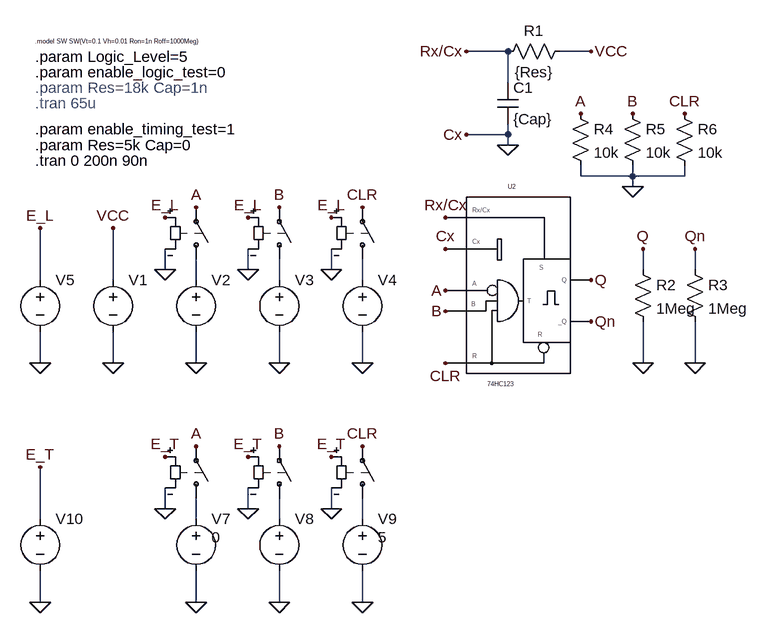
[diagram p0: schematic Test (If Spice works) 74HC123.asc]
Test (If Spice works) 74HC123.asc, the LTspice schematic file:
Version 4.1
SHEET 1 1260 1556
WIRE 240 -160 176 -160
WIRE 368 -160 320 -160
WIRE 240 -112 240 -160
WIRE 240 -32 240 -48
WIRE 240 -32 176 -32
WIRE 240 -16 240 -32
WIRE 352 32 352 16
WIRE 432 32 432 16
WIRE 432 32 352 32
WIRE 512 32 512 16
WIRE 512 32 432 32
WIRE 432 48 432 32
WIRE -288 176 -288 144
WIRE -160 176 -160 144
WIRE -32 176 -32 144
WIRE 448 176 448 144
WIRE 528 176 528 144
WIRE -480 192 -480 112
WIRE -368 192 -368 112
WIRE -240 192 -240 160
WIRE -112 192 -112 160
WIRE 16 192 16 160
WIRE -480 320 -480 272
WIRE -368 320 -368 272
WIRE -240 320 -240 272
WIRE -112 320 -112 272
WIRE 16 320 16 272
WIRE 448 320 448 256
WIRE 528 320 528 256
WIRE -288 544 -288 512
WIRE -160 544 -160 512
WIRE -32 544 -32 512
WIRE -480 560 -480 480
WIRE -240 560 -240 528
WIRE -112 560 -112 528
WIRE 16 560 16 528
WIRE -480 688 -480 640
WIRE -240 688 -240 640
WIRE -112 688 -112 640
WIRE 16 688 16 640
FLAG 240 -16 0
FLAG -368 320 0
FLAG 368 -160 VCC
FLAG 144 208 A
FLAG 144 240 B
FLAG 144 320 CLR
FLAG 368 192 Q
FLAG 368 256 Qn
FLAG 448 320 0
FLAG 528 320 0
FLAG 448 144 Q
FLAG 528 144 Qn
FLAG -240 320 0
FLAG -112 320 0
FLAG 16 320 0
FLAG -240 80 A
FLAG -112 80 B
FLAG 16 80 CLR
FLAG 144 96 Rx/Cx
FLAG 176 -160 Rx/Cx
FLAG 144 144 Cx
FLAG 176 -32 Cx
FLAG -368 112 VCC
FLAG -32 176 0
FLAG -160 176 0
FLAG -288 176 0
FLAG -480 320 0
FLAG -480 112 E_L
FLAG -288 96 E_L
FLAG -160 96 E_L
FLAG -32 96 E_L
FLAG 432 48 0
FLAG 352 -64 A
FLAG 432 -64 B
FLAG 512 -64 CLR
FLAG -240 688 0
FLAG -112 688 0
FLAG 16 688 0
FLAG -240 448 A
FLAG -112 448 B
FLAG 16 448 CLR
FLAG -32 544 0
FLAG -160 544 0
FLAG -288 544 0
FLAG -480 688 0
FLAG -480 480 E_T
FLAG -288 464 E_T
FLAG -160 464 E_T
FLAG -32 464 E_T
SYMBOL cap 224 -112 R0
SYMATTR InstName C1
SYMATTR Value {Cap}
SYMBOL res 224 -144 R270
WINDOW 0 32 56 VTop 2
WINDOW 3 0 56 VBottom 2
SYMATTR InstName R1
SYMATTR Value {Res}
SYMBOL voltage -368 176 R0
WINDOW 123 0 0 Left 0
WINDOW 39 0 0 Left 0
WINDOW 3 31 88 Invisible 2
SYMATTR Value {Logic_Level}
SYMATTR InstName V1
SYMBOL res 432 160 R0
SYMATTR InstName R2
SYMATTR Value 1Meg
SYMBOL res 512 160 R0
SYMATTR InstName R3
SYMATTR Value 1Meg
SYMBOL voltage -240 176 R0
WINDOW 3 35 89 Invisible 2
WINDOW 123 0 0 Left 0
WINDOW 39 0 0 Left 0
SYMATTR Value PWL(5u 0 5.001u 5 20u 5 20.001u 0 25u 0 25.001u 5 30u 5 30.001u 0 40u 0 40.001u 5 42u 5 42.001u 0 60u 0)
SYMATTR InstName V2
SYMBOL voltage -112 176 R0
WINDOW 3 25 98 Invisible 2
WINDOW 123 0 0 Left 0
WINDOW 39 0 0 Left 0
SYMATTR Value PWL(5u 0 5.001u 5 10u 5 10.001u 0 15u 0 15.001u 5 20u 5 20.001u 0 32u 0 32.001u 5 60u 5)
SYMATTR InstName V3
SYMBOL voltage 16 176 R0
WINDOW 3 29 96 Invisible 2
WINDOW 123 0 0 Left 0
WINDOW 39 0 0 Left 0
SYMATTR Value PWL(15u 0 15.001u 5 20u 5 20.001u 0 25u 0 25.001u 5 50u 5 50.001u 0 52u 0 52.001u 5 60u 5 60.001 0)
SYMATTR InstName V4
SYMBOL sw -240 176 M180
WINDOW 0 24 16 Invisible 2
WINDOW 3 24 96 Invisible 2
SYMATTR InstName S1
SYMBOL sw -112 176 M180
WINDOW 0 24 16 Invisible 2
WINDOW 3 24 96 Invisible 2
SYMATTR InstName S2
SYMBOL sw 16 176 M180
WINDOW 0 24 16 Invisible 2
WINDOW 3 24 96 Invisible 2
SYMATTR InstName S3
SYMBOL voltage -480 176 R0
WINDOW 3 24 96 Invisible 2
WINDOW 123 0 0 Left 0
WINDOW 39 0 0 Left 0
SYMATTR Value {enable_logic_test * Logic_Level}
SYMATTR InstName V5
SYMBOL res 336 -80 R0
SYMATTR InstName R4
SYMATTR Value 10k
SYMBOL res 416 -80 R0
SYMATTR InstName R5
SYMATTR Value 10k
SYMBOL res 496 -80 R0
SYMATTR InstName R6
SYMATTR Value 10k
SYMBOL voltage -240 544 R0
WINDOW 3 24 44 Left 2
WINDOW 123 0 0 Left 0
WINDOW 39 0 0 Left 0
SYMATTR Value 0
SYMATTR InstName V7
SYMBOL voltage -112 544 R0
WINDOW 3 24 44 Invisible 2
WINDOW 123 0 0 Left 0
WINDOW 39 0 0 Left 0
SYMATTR Value PULSE(0 5 100n 1n 1n 500n 1000n)
SYMATTR InstName V8
SYMBOL voltage 16 544 R0
WINDOW 3 24 44 Left 2
WINDOW 123 0 0 Left 0
WINDOW 39 0 0 Left 0
SYMATTR Value 5
SYMATTR InstName V9
SYMBOL sw -240 544 M180
WINDOW 0 24 16 Invisible 2
WINDOW 3 24 96 Invisible 2
SYMATTR InstName S4
SYMBOL sw -112 544 M180
WINDOW 0 24 16 Invisible 2
WINDOW 3 24 96 Invisible 2
SYMATTR InstName S5
SYMBOL sw 16 544 M180
WINDOW 0 24 16 Invisible 2
WINDOW 3 24 96 Invisible 2
SYMATTR InstName S6
SYMBOL voltage -480 544 R0
WINDOW 3 24 96 Invisible 2
WINDOW 123 0 0 Left 0
WINDOW 39 0 0 Left 0
SYMATTR Value {enable_timing_test * Logic_Level}
SYMATTR InstName V10
SYMBOL ZmySymbol\\IC\\Logic\\74hc123 256 32 R0
SYMATTR InstName U2
TEXT -488 -104 Left 2 ;.param Res=18k Cap=1n
TEXT -488 -128 Left 2 !.param enable_logic_test=0
TEXT -488 -152 Left 2 !.param Logic_Level=5
TEXT -488 -176 Left 0 !.model SW SW(Vt=0.1 Vh=0.01 Ron=1n Roff=1000Meg)
TEXT -488 8 Left 2 !.tran 0 200n 90n
TEXT -488 -16 Left 2 !.param Res=5k Cap=0
TEXT -488 -40 Left 2 !.param enable_timing_test=1
TEXT -488 -80 Left 2 ;.tran 65u

The netlist it stands for:
* Test (If Spice works) 74HC123.asc
C1 Rx/Cx 0 {Cap}
R1 Rx/Cx VCC {Res}
V1 VCC 0 {Logic_Level}
R2 Q 0 1Meg
R3 Qn 0 1Meg
V2 N001 0 PWL(5u 0 5.001u 5 20u 5 20.001u 0 25u 0 25.001u 5 30u 5 30.001u 0 40u 0 40.001u 5 42u 5 42.001u 0 60u 0)
V3 N002 0 PWL(5u 0 5.001u 5 10u 5 10.001u 0 15u 0 15.001u 5 20u 5 20.001u 0 32u 0 32.001u 5 60u 5)
V4 N003 0 PWL(15u 0 15.001u 5 20u 5 20.001u 0 25u 0 25.001u 5 50u 5 50.001u 0 52u 0 52.001u 5 60u 5 60.001 0)
S1 N001 A E_L 0 SW
S2 N002 B E_L 0 SW
S3 N003 CLR E_L 0 SW
V5 E_L 0 {enable_logic_test * Logic_Level}
R4 A 0 10k
R5 B 0 10k
R6 CLR 0 10k
V7 N004 0 0
V8 N005 0 PULSE(0 5 100n 1n 1n 500n 1000n)
V9 N006 0 5
S4 N004 A E_T 0 SW
S5 N005 B E_T 0 SW
S6 N006 CLR E_T 0 SW
V10 E_T 0 {enable_timing_test * Logic_Level}
X§U2 A B CLR 0 Rx/Cx Q Qn VCC 0 74HC123 VCC=5  SPEED=1.0  TRIPDT=1e-9  ; pins A B CLR CGND RC Q QN
* .param Res=18k Cap=1n
.param enable_logic_test=0
.param Logic_Level=5
.model SW SW(Vt=0.1 Vh=0.01 Ron=1n Roff=1000Meg)
.tran 0 200n 90n
.param Res=5k Cap=0
.param enable_timing_test=1
* .tran 65u
.lib 74HC.lib
.backanno
.end